# EAGLE schematic push (EAGLE 7.2.0)
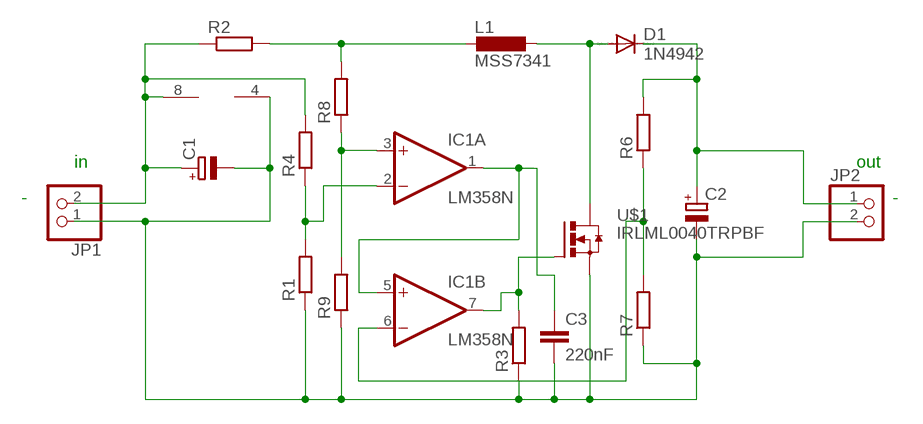
[diagram p0: schematic, sheet 1]

## Parts
C1  CPOL-EUE3.5-8  [E3,5-8]
C2  CPOL-EUE3.5-8  [E3,5-8]
C3  220nF  C-EUC1206  [C1206]
D1  1N4942  [DO41-10]
IC1  LM358N  [DIL08]
JP1  PINHD-1X2  [1X02]
JP2  PINHD-1X2  [1X02]
L1  MSS7341  [MSS7341]
R1  R-EU_R1206  [R1206]
R2  R-EU_R1206  [R1206]
R3  R-EU_R1206  [R1206]
R4  R-EU_R1206  [R1206]
R6  R-EU_R1206  [R1206]
R7  R-EU_R1206  [R1206]
R8  R-EU_R1206  [R1206]
R9  R-EU_R1206  [R1206]
U$1  IRLML0040TRPBF  [MICRO3]

## Nets
N$1: C1.+ IC1.8(P:V+) JP1.2 R2.1 R4.2
N$2: C1.- C2.- C3.2 IC1.4(P:V-) JP1.1 JP2.2 R1.1 R3.1 R7.1 R9.1 U$1.2(S)
N$3: L1.1 R2.2 R8.2
N$4: D1.A L1.2 U$1.3(D)
N$5: C2.+ D1.C JP2.1 R6.2
N$6: IC1.7(B:OUT) R3.2 U$1.1(G)
N$7: IC1.2(A:-IN) R1.2 R4.1
N$8: C3.1 IC1.1(A:OUT) IC1.5(B:+IN)
N$9: IC1.3(A:+IN) R8.1 R9.2
N$10: IC1.6(B:-IN) R6.1 R7.2

## Notes on the sheet
- in | out
- - | -

## Library data of the parts
C1 C2 = resistor:CPOL-EU: POLARIZED CAPACITOR, European symbol
C3 = resistor:C-EU: CAPACITOR, European symbol
D1 = diode:1N4942: DIODE 1.0 A, 200 V, 150 ns
IC1 = linear:LM358: OP AMP also LM158; LM258; LM2904 Source: http://cache.national.com/ds/LM/LM158.pdf
JP1 JP2 = pinhead:PINHD-1X2: PIN HEADER
L1 = inductor-coilcraft:MSS7341: Shielded Power Inductors Package 6.6 × 6.6 mm x 4.1 mm high Source: http://www.farnell.com/datasheets/1681958.pdf
R1-R4 R6-R9 = resistor:R-EU_: RESISTOR, European symbol
U$1 = transistor-power:IRLML0040TRPBF: IRLML0040TRPbF NPN MOSFET 40 V 3.6 A